# Altium schematic sheet RCJ_OnStage2024_FC_sensors.SchDoc
size 594 x 420 mm; SheetNumber: 3; SheetTotal: 4; SheetSize: А3
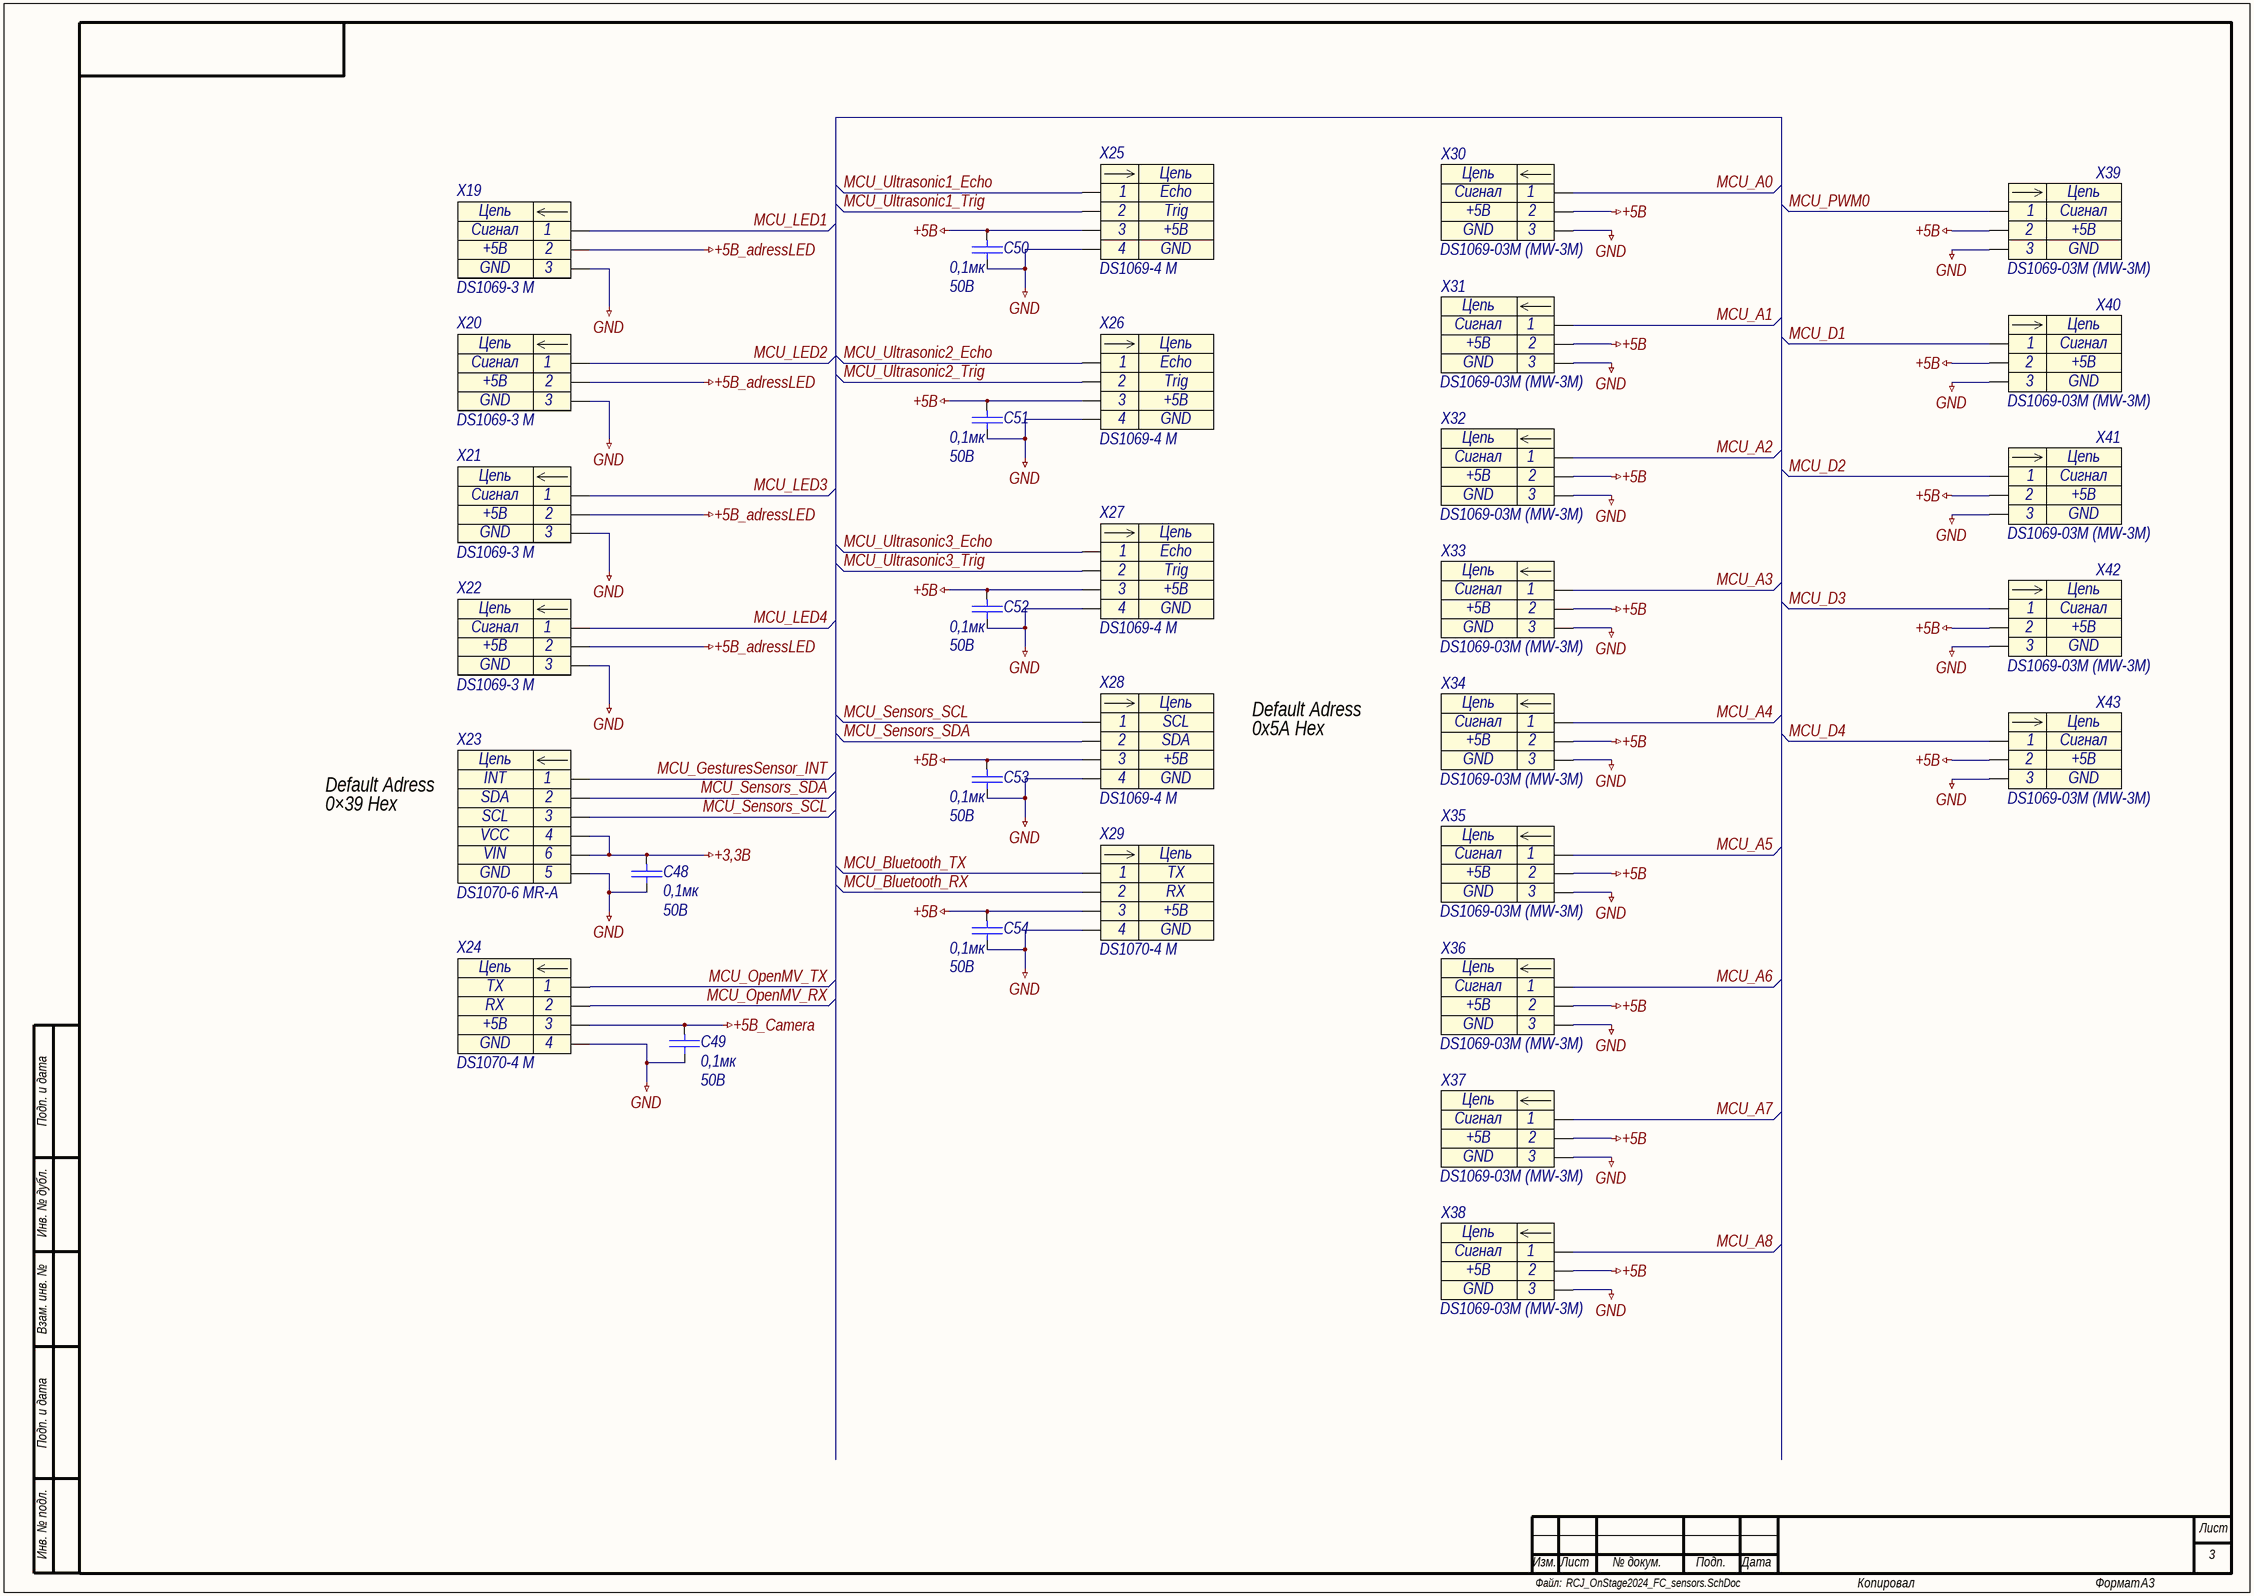
[diagram p0: RCJ_OnStage2024_FC_sensors.SchDoc]

## Parts
C48  0,1мк  Voltage: 50В  [C0603]
C49  0,1мк  Voltage: 50В  [C0603]
C50  0,1мк  Voltage: 50В  [C0603]
C51  0,1мк  Voltage: 50В  [C0603]
C52  0,1мк  Voltage: 50В  [C0603]
C53  0,1мк  Voltage: 50В  [C0603]
C54  0,1мк  Voltage: 50В  [C0603]
X19  DS1069-3 M  [DS1070-3]
X20  DS1069-3 M  [DS1070-3]
X21  DS1069-3 M  [DS1070-3]
X22  DS1069-3 M  [DS1070-3]
X23  DS1070-6 MR-A  [DS1070-6]
X24  DS1070-4 M  [DS1070-4]
X25  DS1069-4 M  [DS1069-4]
X26  DS1069-4 M  [DS1069-4]
X27  DS1069-4 M  [DS1069-4]
X28  DS1069-4 M  [DS1069-4]
X29  DS1070-4 M  [DS1070-4]
X30  DS1069-03M (MW-3M)  [PLS-3]
X31  DS1069-03M (MW-3M)  [PLS-3]
X32  DS1069-03M (MW-3M)  [PLS-3]
X33  DS1069-03M (MW-3M)  [PLS-3]
X34  DS1069-03M (MW-3M)  [PLS-3]
X35  DS1069-03M (MW-3M)  [PLS-3]
X36  DS1069-03M (MW-3M)  [PLS-3]
X37  DS1069-03M (MW-3M)  [PLS-3]
X38  DS1069-03M (MW-3M)  [PLS-3]
X39  DS1069-03M (MW-3M)  [PLS-3]
X40  DS1069-03M (MW-3M)  [PLS-3]
X41  DS1069-03M (MW-3M)  [PLS-3]
X42  DS1069-03M (MW-3M)  [PLS-3]
X43  DS1069-03M (MW-3M)  [PLS-3]

## Nets
+3,3В: C48.2 X23.4 X23.5
+5В: C50.2 C51.2 C52.2 C53.2 C54.2 X25.3 X26.3 X27.3 X28.3 X29.3 X30.2 X31.2 X32.2 X33.2 X34.2 X35.2 X36.2 X37.2 X38.2 X39.2 X40.2 X41.2 X42.2 X43.2
+5В_adressLED: X19.2 X20.2 X21.2 X22.2
+5В_Camera: C49.2 X24.3
GND: C48.1 C49.1 C50.1 C51.1 C52.1 C53.1 C54.1 X19.3 X20.3 X21.3 X22.3 X23.6 X24.4 X25.4 X26.4 X27.4 X28.4 X29.4 X30.3 X31.3 X32.3 X33.3 X34.3 X35.3 X36.3 X37.3 X38.3 X39.3 X40.3 X41.3 X42.3 X43.3
MCU_A0: X30.1
MCU_A1: X31.1
MCU_A2: X32.1
MCU_A3: X33.1
MCU_A4: X34.1
MCU_A5: X35.1
MCU_A6: X36.1
MCU_A7: X37.1
MCU_A8: X38.1
MCU_Bluetooth_RX: X29.2
MCU_Bluetooth_TX: X29.1
MCU_D1: X40.1
MCU_D2: X41.1
MCU_D3: X42.1
MCU_D4: X43.1
MCU_GesturesSensor_INT: X23.1
MCU_LED1: X19.1
MCU_LED2: X20.1
MCU_LED3: X21.1
MCU_LED4: X22.1
MCU_OpenMV_RX: X24.2
MCU_OpenMV_TX: X24.1
MCU_PWM0: X39.1
MCU_Sensors_SCL: X23.3 X28.1
MCU_Sensors_SDA: X23.2 X28.2
MCU_Ultrasonic1_Echo: X25.1
MCU_Ultrasonic1_Trig: X25.2
MCU_Ultrasonic2_Echo: X26.1
MCU_Ultrasonic2_Trig: X26.2
MCU_Ultrasonic3_Echo: X27.1
MCU_Ultrasonic3_Trig: X27.2

## Notes on the sheet
- 0x5A Hex
- Default Adress
- 0×39 Hex
- Подп. и дата
- Инв. № дубл.
- Взам. инв. №
- Инв. № подл.
- Лист
- Файл:
- Изм.
- № докум.
- Подп.
- Дата
- Копировал
- Формат
- (in symbol PLS-3) Цепь
- (in symbol WF-3) Цепь
- (in symbol WF-4) Цепь
- (in symbol WF-6) Цепь

## Library data of the parts
C48-C54 = GRM188R71H104KA93D: Конденсатор кер. 0,1мкФ 50В X7R; Manufacturer: Murata; Name: GRM188R71H104KA93D; TKE: X7R; Value: 0,1мк
X19-X22 = WF-3: Вилка на плату 2.5мм открытая 3pin; Contact_1: Сигнал; Contact_2: +5В; Contact_3: GND; Name: DS1069-3 M
X23 = WF-6: Вилка на плату 2.54мм 6pin угловая закрытая тип А; Contact_1: INT; Contact_2: SDA; Contact_3: SCL; Contact_4: VCC; Contact_5: VIN; Contact_6: GND; Name: DS1070-6 MR-A
X24 X29 = WF-4: Вилка на плату 2.54мм открытая 4pin; Contact_1: TX; Contact_2: RX; Contact_3: +5В; Contact_4: GND; Name: DS1070-4 M
X25-X27 = WF-4: Вилка на плату 2.5мм открытая 4pin; Contact_1: Echo; Contact_2: Trig; Contact_3: +5В; Contact_4: GND; Name: DS1069-4 M
X28 = WF-4: Вилка на плату 2.5мм открытая 4pin; Contact_1: SCL; Contact_2: SDA; Contact_3: +5В; Contact_4: GND; Name: DS1069-4 M
X30-X43 = PLS-3: Разъем - 3 конт. прямая вилка на плату; Contact_1: Сигнал; Contact_2: +5В; Contact_3: GND; Name: DS1069-03M (MW-3M)